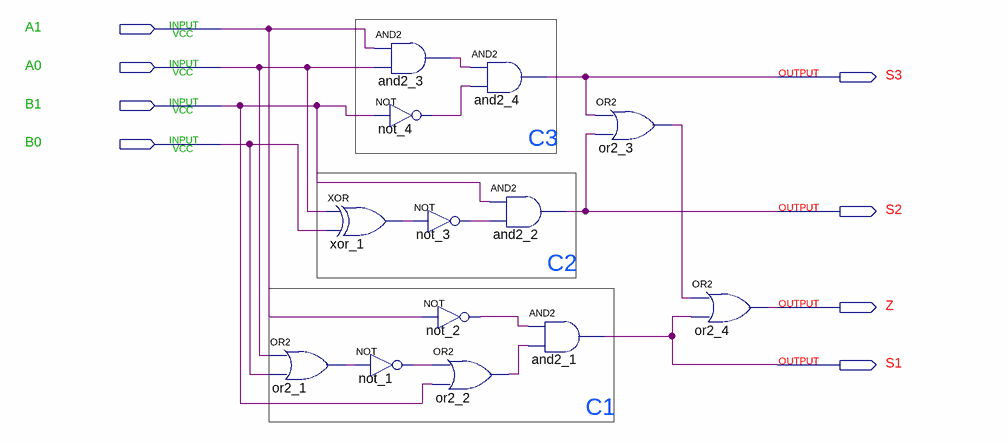
[diagram p0: schematic sheet]
// Quartus schematic exp02_2.bdf as structural Verilog: 13 symbols, 8 pins
module exp02_2 (
  input  A1,
  input  A0,
  input  B1,
  input  B0,
  output S3,
  output S2,
  output Z,
  output S1
);

  wire and2_3_out, not_1_out, not_2_out, not_3_out, not_4_out, or2_1_out, or2_2_out, or2_3_out, xor_1_out;

  or or2_1 (or2_1_out, A0, B0);
  xor xor_1 (xor_1_out, A0, B0);
  not not_1 (not_1_out, or2_1_out);
  and and2_3 (and2_3_out, A1, A0);
  not not_4 (not_4_out, B1);
  not not_3 (not_3_out, xor_1_out);
  not not_2 (not_2_out, A1);
  or or2_2 (or2_2_out, not_1_out, B1);
  and and2_4 (S3, and2_3_out, not_4_out);
  and and2_2 (S2, B1, not_3_out);
  and and2_1 (S1, not_2_out, or2_2_out);
  or or2_3 (or2_3_out, S3, S2);
  or or2_4 (Z, or2_3_out, S1);

  // Notes on the sheet:
  //   C3
  //   C2
  //   C1
endmodule
